# EAGLE schematic Gun_Magazine (EAGLE 7.6.0)
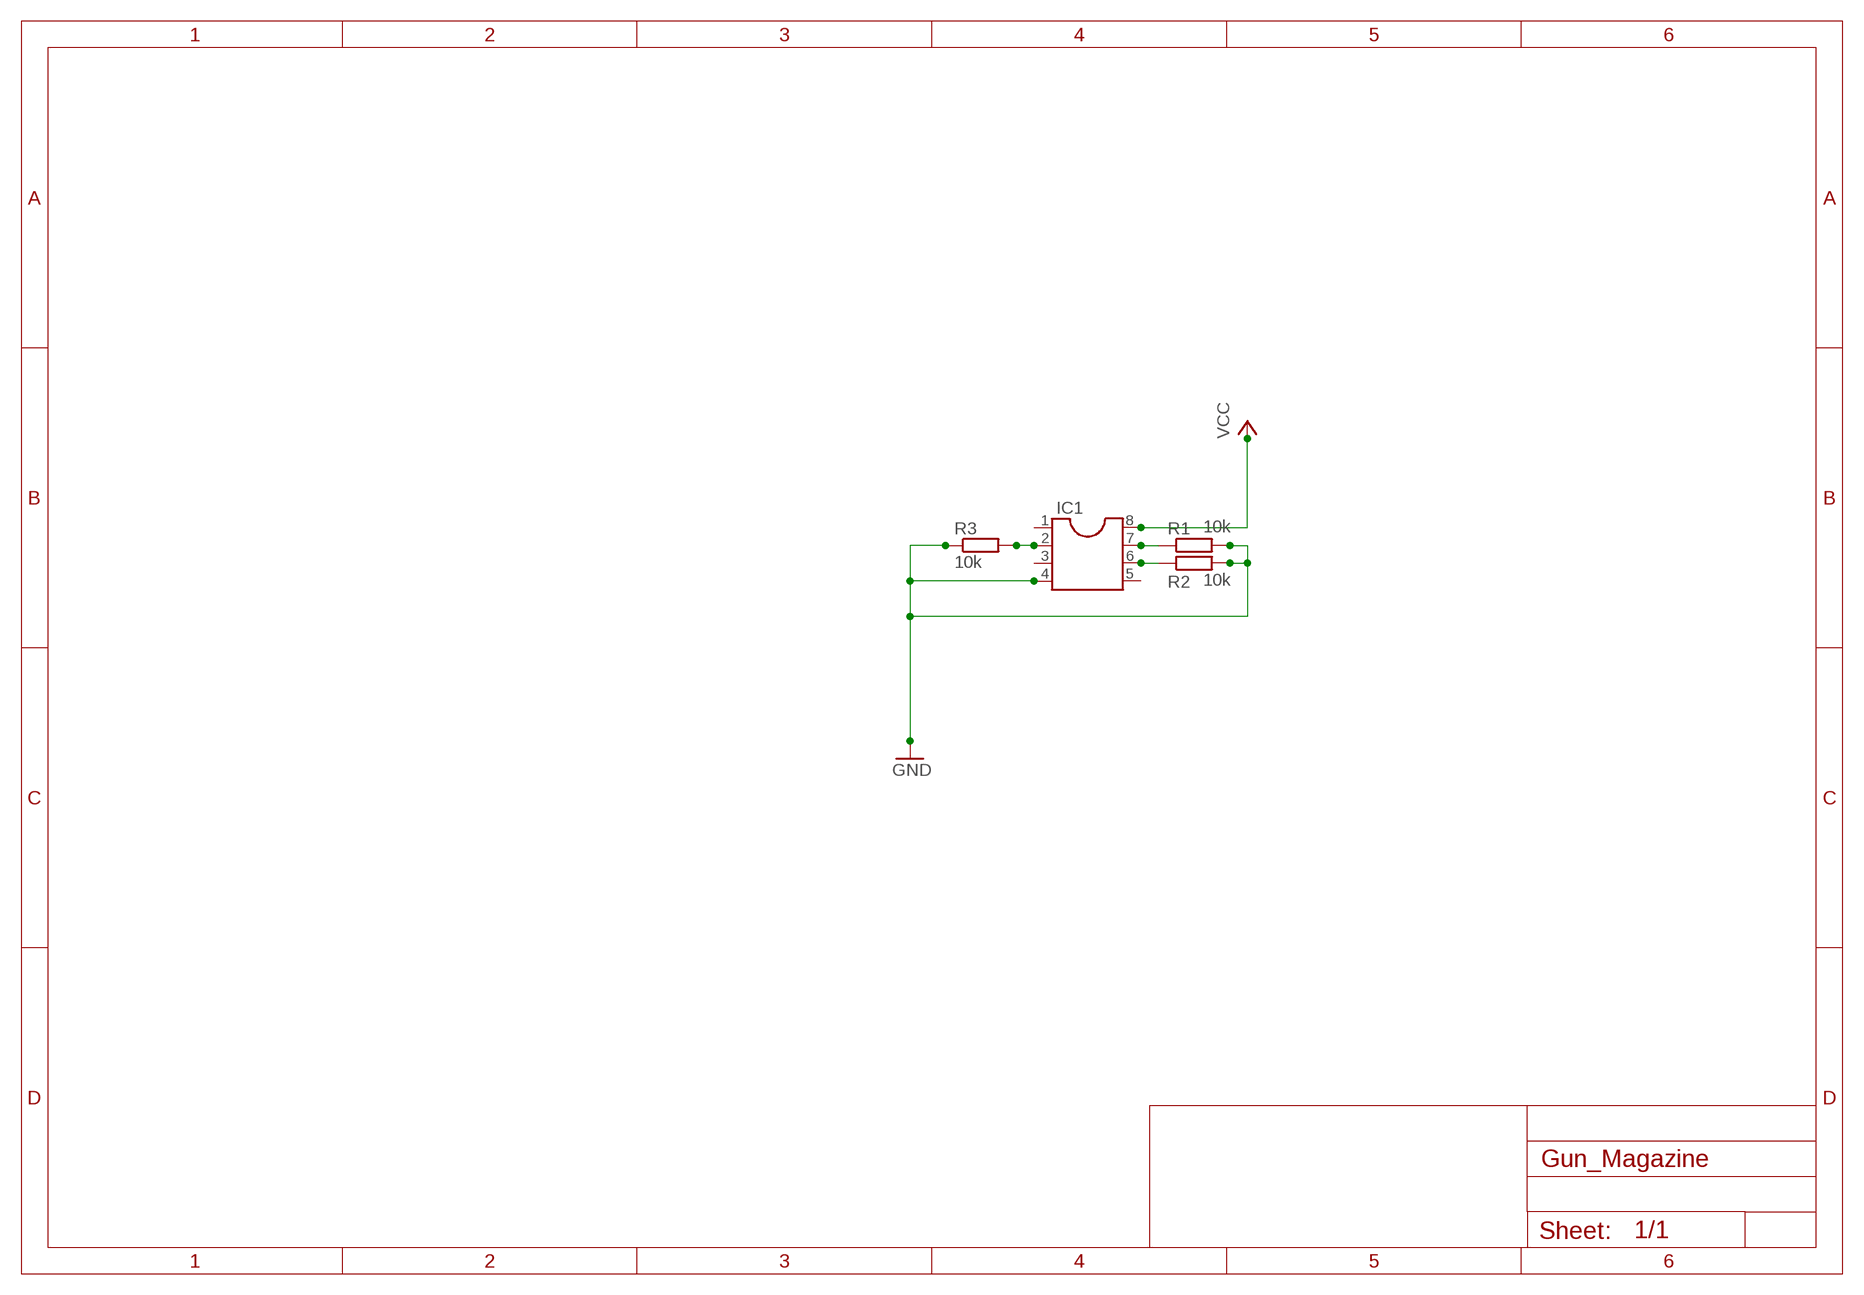
[diagram p0: schematic, sheet 1]

## Parts
IC1  DIL8  [DIL08]
R1  10k  R-EU_0207/7  [0207/7]
R2  10k  R-EU_0207/7  [0207/7]
R3  10k  R-EU_0207/7  [0207/7]

## Nets
GND: IC1.4 R1.2 R2.2 R3.1
N$9: IC1.2 R3.2
N$10: IC1.7 R1.1
N$11: IC1.6 R2.1
VCC: IC1.8
Unconnected: IC1.1 IC1.3 IC1.5

## Library data of the parts
IC1 = ic-package:DIL8: Dual In Line / Socket
R1-R3 = resistor:R-EU_: RESISTOR, European symbol